# Altium schematic sheet Analog Signal Filter.SchDoc
size A; SheetNumber: 6; SheetTotal: 9
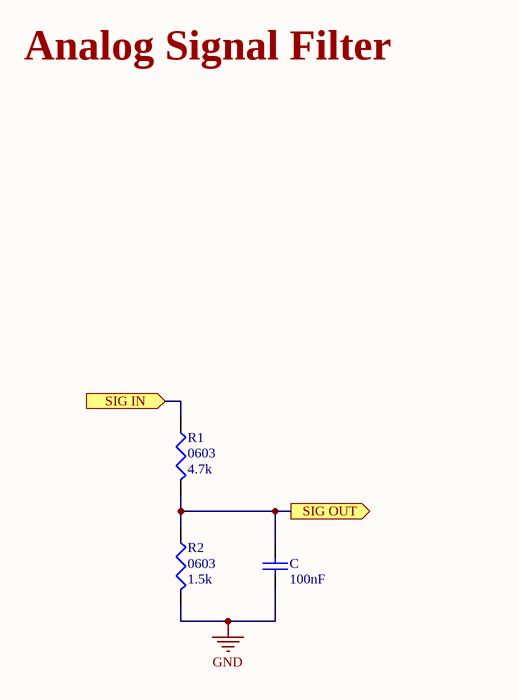
[diagram p0: Analog Signal Filter.SchDoc]

## Parts
C  100nF  [CAPC1608X95X40ML15T15]
R1  0603  value 4.7k  [J1-0603]
R2  0603  value 1.5k  [J1-0603]

## Ports
SIG IN (in), SIG OUT (out)

## Nets
GND: C.1 R2.2
SIG IN: R1.1 ; port SIG IN
SIG OUT: C.2 R1.2 R2.1 ; port SIG OUT

## Notes on the sheet
- Analog Signal Filter

## Library data of the parts
C = CMP-2006-01550-1: Manufacturer: Vitramon; Part Number: VJ0603Y104KXQCW1BC
R1 R2 = Res3: Resistor; Published: 8-Jun-2000; LatestRevisionDate: 29-May-2009; LatestRevisionNote: IPC-7351 Footprint Added.; PackageReference: J1-0603; Publisher: Altium Limited; PackageDescription: Chip Resistor